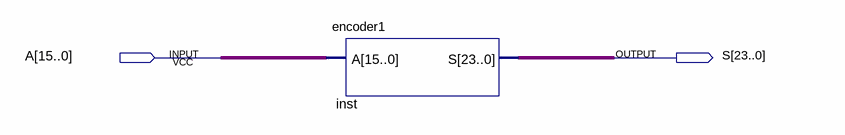
[diagram p0: schematic sheet]
// Quartus schematic encoder_bdf.bdf as structural Verilog: 1 symbols, 2 pins
module encoder_bdf (
  input  [15:0] A,
  output [23:0] S
);

  encoder1 inst (.A(A), .S(S));
endmodule
